# EAGLE schematic schematic (EAGLE 7.3.0)
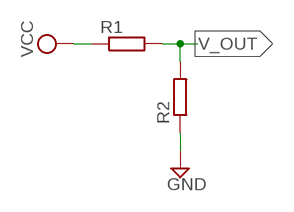
[diagram p0: schematic, sheet 1]

## Parts
R1  R-EU_0207/10  [0207/10]
R2  R-EU_0207/10  [0207/10]

## Nets
A: R1.1 ; supply symbol labelled VCC
GND: R2.1
V_OUT: R1.2 R2.2

## Library data of the parts
R1 R2 = rcl:R-EU_: RESISTOR, European symbol